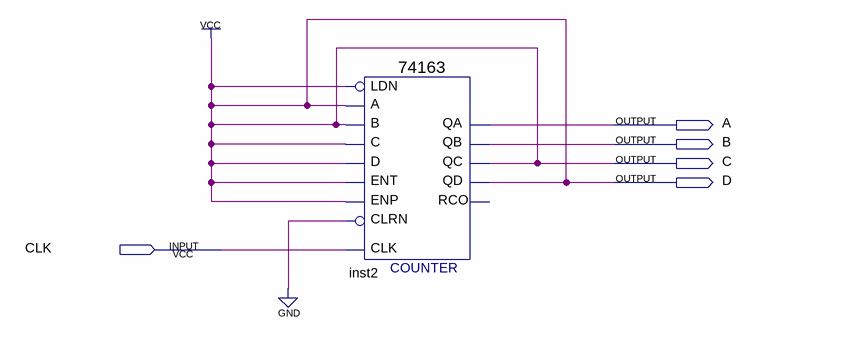
[diagram p0: schematic sheet]
// Quartus schematic MSpecialCount.bdf as structural Verilog: 1 symbols, 5 pins
module MSpecialCount (
  input  CLK,
  output A,
  output B,
  output C,
  output D
);

  \74163  inst2 (
    .C(C), .B(C), .A(C), .ENT(C), .D(C), .CLRN(1'b0), .CLK(CLK), .ENP(C), .LDN(C), .QA(A), .QB(B), .QC(C),
    .QD(C));  // open: RCO

  assign D = C;
  // also tied to VCC on the sheet: C
endmodule
